# EAGLE design LED-board (EAGLE 7.3.0)
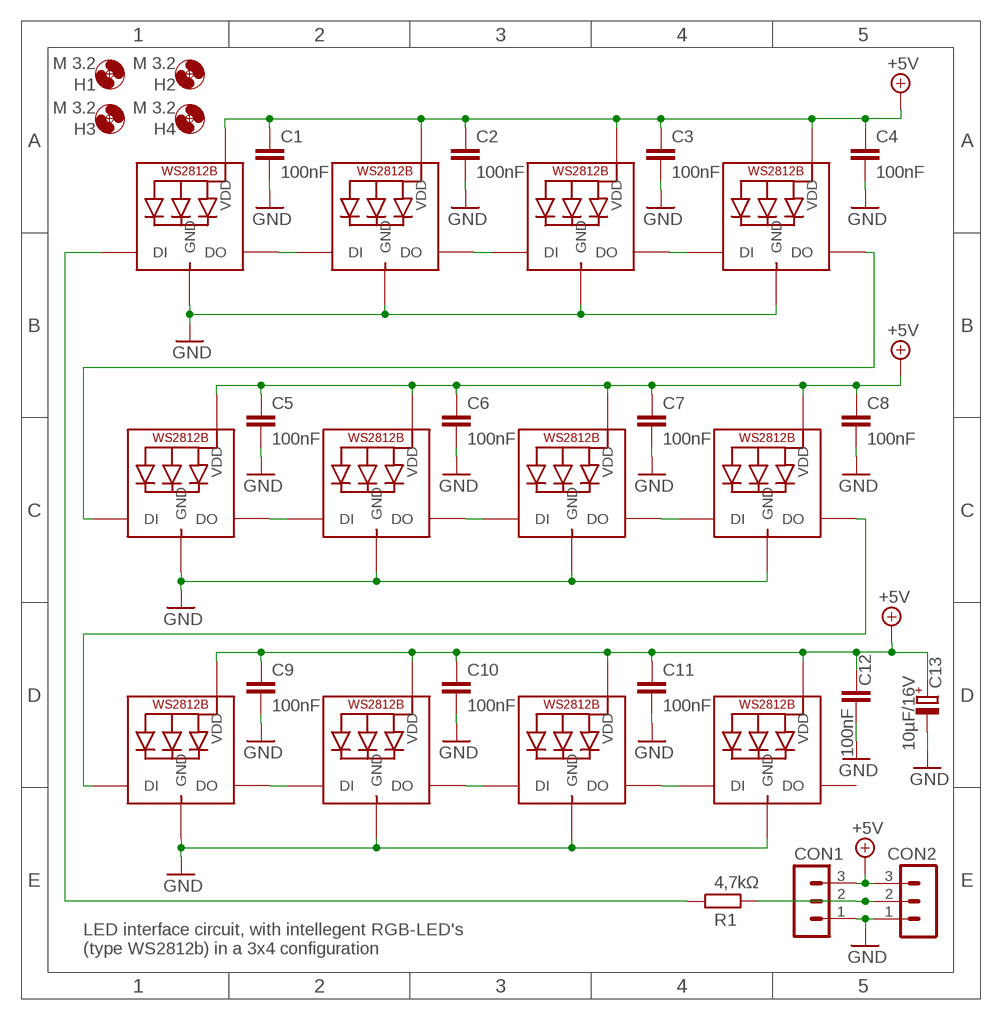
[diagram p0: schematic, sheet 1]

## Parts
C1  100nF  C-EU050-025X075  [C050-025X075]
C2  100nF  C-EU050-025X075  [C050-025X075]
C3  100nF  C-EU050-025X075  [C050-025X075]
C4  100nF  C-EU050-025X075  [C050-025X075]
C5  100nF  C-EU050-025X075  [C050-025X075]
C6  100nF  C-EU050-025X075  [C050-025X075]
C7  100nF  C-EU050-025X075  [C050-025X075]
C8  100nF  C-EU050-025X075  [C050-025X075]
C9  100nF  C-EU050-025X075  [C050-025X075]
C10  100nF  C-EU050-025X075  [C050-025X075]
C11  100nF  C-EU050-025X075  [C050-025X075]
C12  100nF  C-EU050-025X075  [C050-025X075]
C13  10µF/16V  CPOL-EUE2-5  [E2-5]
CON1  MA03-1  [MA03-1]
CON2  MA03-1  [MA03-1]
H1  M 3.2  MOUNT-HOLE3.2  [3,2]
H2  M 3.2  MOUNT-HOLE3.2  [3,2]
H3  M 3.2  MOUNT-HOLE3.2  [3,2]
H4  M 3.2  MOUNT-HOLE3.2  [3,2]
LED1  WS2812B5050  [WS2812B]
LED2  WS2812B5050  [WS2812B]
LED3  WS2812B5050  [WS2812B]
LED4  WS2812B5050  [WS2812B]
LED5  WS2812B5050  [WS2812B]
LED6  WS2812B5050  [WS2812B]
LED7  WS2812B5050  [WS2812B]
LED8  WS2812B5050  [WS2812B]
LED9  WS2812B5050  [WS2812B]
LED10  WS2812B5050  [WS2812B]
LED11  WS2812B5050  [WS2812B]
LED12  WS2812B5050  [WS2812B]
R1  4,7kΩ  R-EU_0207/7  [0207/7]

## Nets
+5V: C1.1 C2.1 C3.1 C4.1 C5.1 C6.1 C7.1 C8.1 C9.1 C10.1 C11.1 C12.1 C13.+ CON1.3 CON2.3 LED1.1-VDD(VDD) LED2.1-VDD(VDD) LED3.1-VDD(VDD) LED4.1-VDD(VDD) LED5.1-VDD(VDD) LED6.1-VDD(VDD) LED7.1-VDD(VDD) LED8.1-VDD(VDD) LED9.1-VDD(VDD) LED10.1-VDD(VDD) LED11.1-VDD(VDD) LED12.1-VDD(VDD)
GND: C1.2 C2.2 C3.2 C4.2 C5.2 C6.2 C7.2 C8.2 C9.2 C10.2 C11.2 C12.2 C13.- CON1.1 CON2.1 LED1.3-GND(GND) LED2.3-GND(GND) LED3.3-GND(GND) LED4.3-GND(GND) LED5.3-GND(GND) LED6.3-GND(GND) LED7.3-GND(GND) LED8.3-GND(GND) LED9.3-GND(GND) LED10.3-GND(GND) LED11.3-GND(GND) LED12.3-GND(GND)
N$2: CON1.2 CON2.2 R1.2
N$3: LED1.2-DOUT(DO) LED2.4-DIN(DI)
N$4: LED2.2-DOUT(DO) LED3.4-DIN(DI)
N$5: LED3.2-DOUT(DO) LED4.4-DIN(DI)
N$6: LED1.4-DIN(DI) R1.1
N$8: LED5.2-DOUT(DO) LED6.4-DIN(DI)
N$9: LED6.2-DOUT(DO) LED7.4-DIN(DI)
N$10: LED7.2-DOUT(DO) LED8.4-DIN(DI)
N$11: LED8.2-DOUT(DO) LED9.4-DIN(DI)
N$12: LED9.2-DOUT(DO) LED10.4-DIN(DI)
N$13: LED10.2-DOUT(DO) LED11.4-DIN(DI)
N$14: LED11.2-DOUT(DO) LED12.4-DIN(DI)
N$15: LED4.2-DOUT(DO) LED5.4-DIN(DI)
Unconnected: LED12.2-DOUT(DO)

## Notes on the sheet
- LED interface circuit, with intellegent RGB-LED's 
  (type WS2812b) in a 3x4 configuration

## Library data of the parts
C1-C12 = rcl:C-EU: CAPACITOR, European symbol
C13 = rcl:CPOL-EU: POLARIZED CAPACITOR, European symbol
CON1 CON2 = con-lstb:MA03-1: PIN HEADER; OC_FARNELL: unknown; OC_NEWARK: unknown
H1-H4 = holes:MOUNT-HOLE: MOUNTING HOLE with drill center marker
LED1-LED12 = adafruit:WS2812B
R1 = rcl:R-EU_: RESISTOR, European symbol

## Board
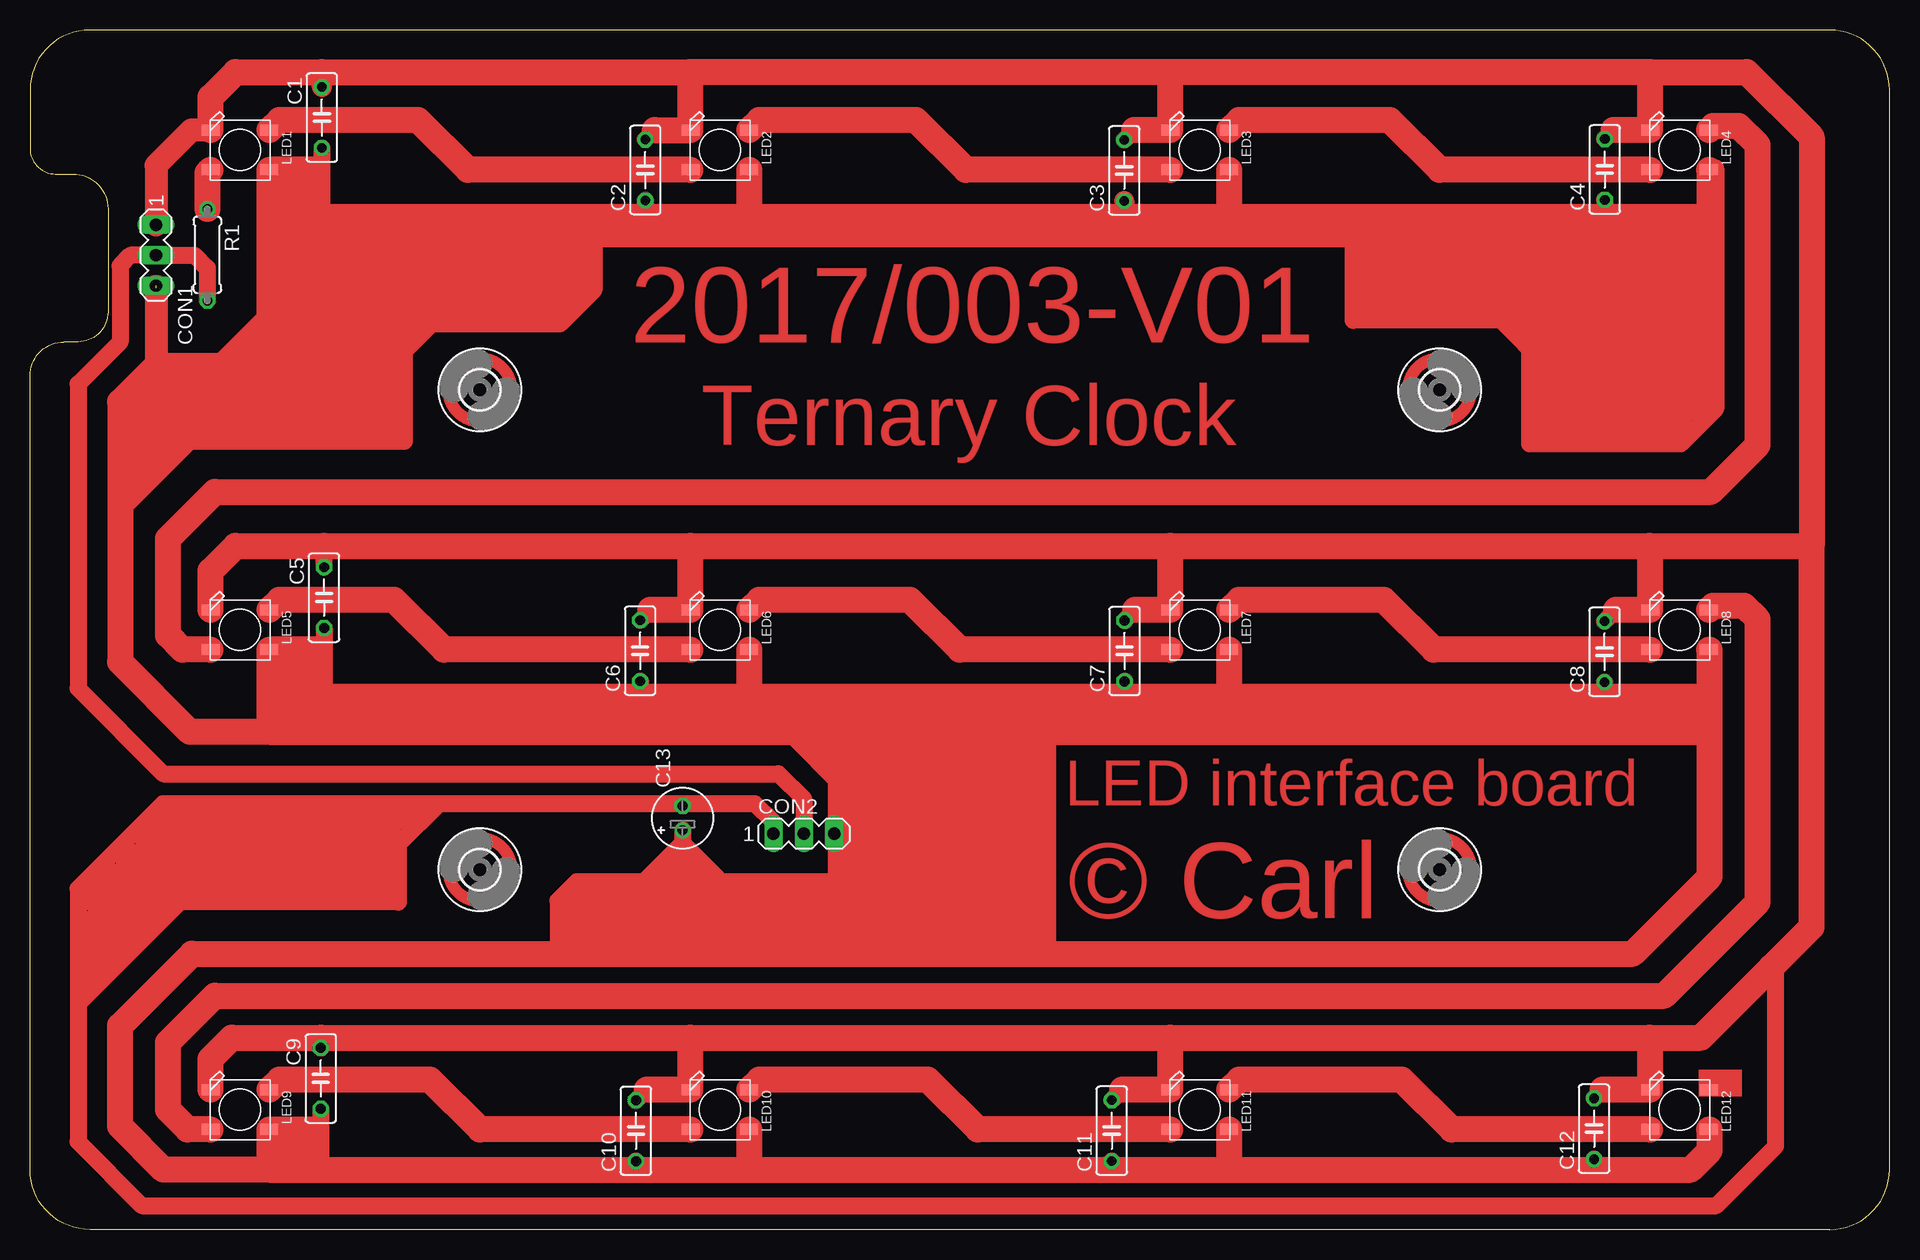
[diagram p1: board, top side]

Size 155 x 100 mm. Coordinates in mm from the lower left corner, seen from the top.
Outline: 150,0 5,0 arc-90 0,5 0,71.17 arc-90 2.83,74 4,74 arc90 6.5,76.5 6.5,85.08 arc90 3.58,88 2.12,88 arc-90 0,90.12 0,95 arc-90 5,100 150,100 arc-90 155,95 155,5 arc-90 150,0
Copper layers (1*16): Top 0.035mm / dielectric 1.5mm / Bottom 0.035mm
Design rules "default": minimum track width 10mil, minimum drill 24mil, track to track 8mil, track to pad 8mil, pad to pad 8mil, via to via 8mil, smd to smd 8mil, copper to edge 40mil, drill to drill 8mil, minimum pad ring 10mil, minimum via ring 8mil, stop-mask expansion 4mil, vias tented up to drill 0mil, thermal gap 10mil

### Footprints (pad centres in the part's own frame; a part is rotated, then mirrored left to right if it is on the bottom)
C050-025X075 = drill 0.813 octagon: 1 -2.54,0; 2 2.54,0
E2-5 = drill 0.813 pad 1.27: + -1.016,0 | drill 0.813 pad 1.27 octagon: - 1.016,0
MA03-1 = drill 1.016 long: 1 -2.54,0; 2 0,0; 3 2.54,0
3,2 = hole 3.2: 0,0
WS2812B = smd 1.5 x 0.9: 1-VDD 2.45,-1.65; 2-DOUT 2.45,1.65; 3-GND -2.45,1.65; 4-DIN -2.45,-1.65
0207/7 = drill 0.813 octagon: 1 -3.81,0; 2 3.81,0

### Placement (x,y rotation side)
C1  24.33,92.7 90 top
C2  51.29,88.33 90 top
C3  91.21,88.29 90 top
C4  131.27,88.37 90 top
C5  24.52,52.68 90 top
C6  50.86,48.25 90 top
C7  91.24,48.23 90 top
C8  131.25,48.17 90 top
C9  24.24,12.6 90 top
C10  50.52,8.23 90 top
C11  90.17,8.24 90 top
C12  130.38,8.4 90 top
C13  54.4,34.3 90 top
CON1  10.5,81.22 270 top
CON2  64.5,33 0 top
H1  117.5,30 90 top
H2  37.5,30 270 top
H3  117.5,70 180 top
H4  37.5,70 90 top
LED1  17.5,90 0 top
LED2  57.5,90 0 top
LED3  97.5,90 0 top
LED4  137.5,90 0 top
LED5  17.5,50 0 top
LED6  57.5,50 0 top
LED7  97.5,50 0 top
LED8  137.5,50 0 top
LED9  17.5,10 0 top
LED10  57.5,10 0 top
LED11  97.5,10 0 top
LED12  137.5,10 0 top
R1  14.79,81.26 270 top

### Tracks (layer width: path | path; a pad name or v marks a point on that pad's centre or on a via)
+5V  (1 unrouted)
  Top 1.27: 54.4,23 54.5,23 | 50.9,28.8 54.4,32.3 56.6,30.1 | 57.4,29.3 56.6,30.1 | 56.6,30.1 53.1,30.1
  Top 1.422: C2.1 51.29,83 | C4.1 131.27,83 | C6.1 50.86,41.5 | C7.1 91.24,41.5 | C8.1 131.25,41.5 | C12.1 130.38,5 | C11.1 90.17,5 | C10.1 50.52,5 | C9.1 24.24,5 | C5.1 24.52,41.5 | C1.1 24.33,83 | CON2.3 70,33 70,41.5 | 67.5,37.5 67.2,37.5 64,40.7 64,41.5 | 140,88 140,88.5 140.5,88.5 140.5,68.42 137.59,65.5 125,65.5 125,82.5 | C13.+ 54.4,32.3 54.4,23
  Top 1.676: C3.1 91.21,83
  Top 1.93: 10.5,78.5 10.5,72
  Top 2.184: 19.95,83 24.33,83 51.29,83 59.95,83 | 59.95,83 91.21,83 99.95,83 | 99.95,83 131.27,83 140,83 140,88 140,88.3 LED4.1-VDD | LED2.1-VDD 59.95,83 | LED3.1-VDD 99.95,83 | LED1.1-VDD 19.95,83 | LED5.1-VDD 19.95,41.5 | 19.95,41.5 24.52,41.5 50.86,41.5 59.95,41.5 | 59.95,41.5 64,41.5 70,41.5 91.24,41.5 99.95,41.5 | 99.95,41.5 131.25,41.5 140,41.5 | 140,41.5 140,48.35 LED8.1-VDD | LED6.1-VDD 59.95,41.5 | LED7.1-VDD 99.95,41.5 | 19.95,5 24.24,5 50.52,5 59.95,5 | 59.95,5 90.17,5 99.95,5 | 99.95,5 130.38,5 138.42,5 140,6.58 140,8.35 LED12.1-VDD | LED11.1-VDD 99.95,5 | LED10.1-VDD 59.95,5 | LED9.1-VDD 19.95,5 | 19.95,5 11.11,5 7.5,8.61 7.5,16.98 13.52,23 54.5,23 133.6,23 140,29.4 140,41.5 | 19.95,41.5 13.33,41.5 7.5,47.33 7.5,69 10.5,72 16.08,72 19.95,75.87 19.95,83 | 10.5,78.5
GND
  Top 1.27: C13.- 54.4,35.5 54.5,35.5
  Top 1.422: C2.2 52.07,91.65 | 92.03,91.65 C3.2 | 132.01,91.65 C4.2 | C5.2 24.52,57 | 51.72,51.65 C6.2 | 92.12,51.65 C7.2 | 132.19,51.65 C8.2 | C9.2 24.24,16 | 51.4,11.65 C10.2 | 91.04,11.65 C11.2 | 131.09,11.65 C12.2 | CON2.1 61.96,33.97 60.43,35.5 54.5,35.5 11.07,35.5 4,28.43 4,7.32 9.31,2 140.55,2 145.5,6.95 145.5,21.86 145.14,21.86
  Top 1.676: C1.2 24.33,96.5
  Top 1.93: LED1.3-GND 13.44,91.65 10.5,88.72 CON1.1
  Top 2.184: LED1.3-GND 15.05,94.41 17.14,96.5 24.33,96.5 55,96.5 | 55,96.5 55,91.65 LED2.3-GND 52.07,91.65 | 135.05,96.5 LED4.3-GND 132.01,91.65 | 135.05,96.5 95.05,96.5 | 95.05,96.5 55,96.5 | 95.05,96.5 LED3.3-GND 92.03,91.65 | LED5.3-GND 15.05,54.91 17.14,57 24.52,57 55.05,57 | 55.05,57 95.05,57 | 95.05,57 135,57 | 135,57 135,51.65 | 135,51.65 LED8.3-GND | 55.05,57 LED6.3-GND 51.72,51.65 | 95.05,57 LED7.3-GND 92.12,51.65 | 135,51.65 132.19,51.65 | LED9.3-GND 15.05,14.22 16.83,16 24.24,16 55.05,16 | 55.05,16 95.05,16 | 95.05,16 135,16 | 135,16 135,11.65 | 135,11.65 LED12.3-GND | 55.05,16 LED10.3-GND 51.4,11.65 | 95.05,16 LED11.3-GND 91.04,11.65 | 135,11.65 131.09,11.65 | 135,57 148.5,57 | 135.05,96.5 143.09,96.5 148.5,91.09 148.5,57 | 135,16 139.28,16 145.14,21.86 148.5,25.22 148.5,57
N$1
  Top 1.422: 65.5,40.5 66.5,40.5 66.5,39.5
N$2
  Top 1.422: CON2.2 64.5,35.88 62.38,38 11.11,38 4,45.11 4,70.5 7.5,74 7.5,80.34 8.37,81.22 CON1.2 13.72,81.22 14.79,80.15 R1.2
N$3
  Top 2.184: LED2.4-DIN 36.5,88.35 32.35,92.5 20.8,92.5 LED1.2-DOUT
N$4
  Top 2.184: LED3.4-DIN 78,88.35 73.85,92.5 60.8,92.5 LED2.2-DOUT
N$5
  Top 2.184: LED4.4-DIN 117.5,88.35 113.35,92.5 100.8,92.5 LED3.2-DOUT
N$6
  Top 2.184: LED1.4-DIN 14.79,88.09 R1.1
N$7
  Top 1.422: 68,29 45.58,29 44,27.42 44,23.5
N$8
  Top 2.184: LED6.4-DIN 34.5,48.35 30.35,52.5 20.8,52.5 LED5.2-DOUT
N$9
  Top 2.184: LED7.4-DIN 77.5,48.35 73.35,52.5 60.8,52.5 LED6.2-DOUT
N$10
  Top 2.184: LED8.4-DIN 117,48.35 112.85,52.5 100.8,52.5 LED7.2-DOUT
N$11
  Top 2.184: LED9.4-DIN 13.13,8.35 11.5,9.98 11.5,15.6 15.4,19.5 136.22,19.5 144,27.28 144,50.88 142.88,52 140.3,52 LED8.2-DOUT
N$12
  Top 2.184: LED10.4-DIN 37.5,8.35 33.35,12.5 20.8,12.5 LED9.2-DOUT
N$13
  Top 2.184: LED11.4-DIN 79,8.35 74.85,12.5 60.8,12.5 LED10.2-DOUT
N$14
  Top 2.184: LED12.4-DIN 118.5,8.35 114.35,12.5 100.8,12.5 LED11.2-DOUT
N$15
  Top 2.184: LED5.4-DIN 12.69,48.35 11.5,49.54 11.5,57.59 15.4,61.5 140.09,61.5 144,65.41 144,90.42 142.42,92 140.3,92 LED4.2-DOUT
N$16
  Top 1.422: 46.5,82.5 47,82.5 47,78.33 44.17,75.5 20,75.5
N$17
  Top 1.422: 33.8,75.8 31.2,73.2 31.2,65.7 7.6,65.7 7.6,67.1
N$19
  Top 1.422: 14.6,65.9 13.5,65.9 7.6,60 7.6,61.3 11.2,64.9 9.4,64.9 8.4,63.9
N$20
  Top 1.422: 126.4,71.6 126.4,72 122.6,75.8 110.3,75.8 110.3,82.7
N$21
  Top 1.422: 34,35.4 30.7,32.1 30.7,27.3 4.2,27.3 4.2,27.7
N$22
  Top 1.422: 12.7,27.8 12.7,27.5 4.1,18.9 4.1,20.4 10.3,26.6 8.7,26.6 4.6,22.5 4.6,23.9 7.5,26.8 6,26.8 4.7,25.5
(copper drawn outside any net)
  shapes: Top area x25, Top circle x4

### Text on the board
Top: 2017/003-V01 | Ternary Clock | LED interface board | © Carl
tValues: GND | Data | +5V | Data | +5V | GND